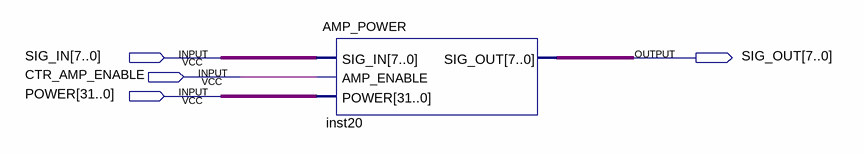
[diagram p0: schematic sheet]
// Quartus schematic EFFECTS_PIPE.bdf as structural Verilog: 1 symbols, 4 pins
module EFFECTS_PIPE (
  input  [7:0] SIG_IN,
  input  CTR_AMP_ENABLE,
  input  [31:0] POWER,
  output [7:0] SIG_OUT
);

  AMP_POWER inst20 (.SIG_IN(SIG_IN), .AMP_ENABLE(CTR_AMP_ENABLE), .POWER(POWER), .SIG_OUT(SIG_OUT));
endmodule
